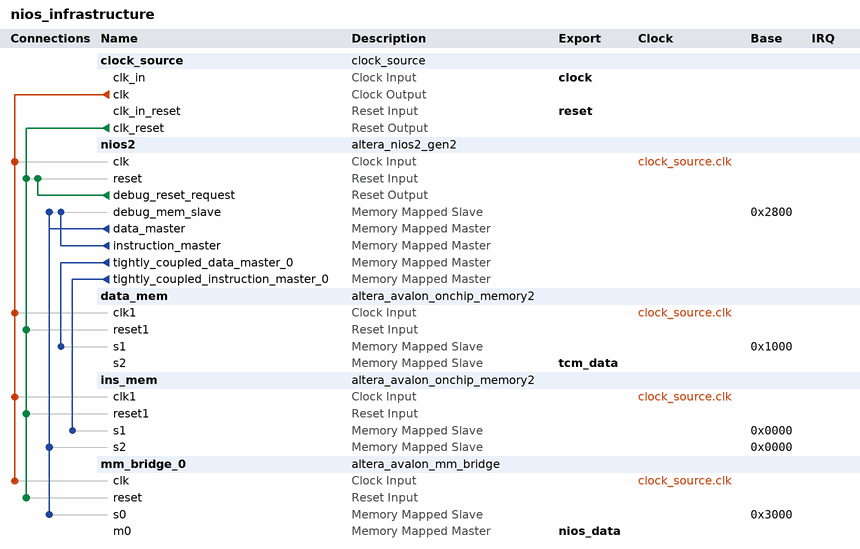
[diagram p0: system contents]
# Platform Designer (Qsys) system nios_infrastructure, Cyclone V 5CSEBA6U23I7
# Parameters at their usual value, and those the tool derives, are not listed.
package require -exact qsys 18.1
create_system nios_infrastructure
set_project_property DEVICE_FAMILY {Cyclone V}
set_project_property DEVICE 5CSEBA6U23I7

add_instance clock_source clock_source 18.1
set_instance_parameter_value clock_source clockFrequency 100000000

add_instance nios2 altera_nios2_gen2 18.1
set_instance_parameter_value nios2 dcache_numTCDM 1
set_instance_parameter_value nios2 dcache_size 0
set_instance_parameter_value nios2 exceptionSlave ins_mem.s1
set_instance_parameter_value nios2 icache_numTCIM 1
set_instance_parameter_value nios2 icache_size 0
set_instance_parameter_value nios2 impl Fast
set_instance_parameter_value nios2 resetSlave ins_mem.s1

add_instance data_mem altera_avalon_onchip_memory2 18.1
set_instance_parameter_value data_mem dataWidth 32
set_instance_parameter_value data_mem dualPort true
set_instance_parameter_value data_mem initMemContent false
set_instance_parameter_value data_mem initializationFileName onchip_mem.hex
set_instance_parameter_value data_mem memorySize 4096
set_instance_parameter_value data_mem singleClockOperation true

add_instance ins_mem altera_avalon_onchip_memory2 18.1
set_instance_parameter_value ins_mem dataWidth 32
set_instance_parameter_value ins_mem dualPort true
set_instance_parameter_value ins_mem initMemContent true
set_instance_parameter_value ins_mem initializationFileName onchip_mem.hex
set_instance_parameter_value ins_mem memorySize 4096
set_instance_parameter_value ins_mem singleClockOperation true

add_instance mm_bridge_0 altera_avalon_mm_bridge 18.1
set_instance_parameter_value mm_bridge_0 ADDRESS_UNITS SYMBOLS
set_instance_parameter_value mm_bridge_0 ADDRESS_WIDTH 10
set_instance_parameter_value mm_bridge_0 DATA_WIDTH 32
set_instance_parameter_value mm_bridge_0 MAX_PENDING_RESPONSES 1
set_instance_parameter_value mm_bridge_0 USE_AUTO_ADDRESS_WIDTH 1

# connections
add_connection clock_source.clk data_mem.clk1 clock
add_connection clock_source.clk ins_mem.clk1 clock
add_connection clock_source.clk mm_bridge_0.clk clock
add_connection clock_source.clk nios2.clk clock
add_connection clock_source.clk_reset data_mem.reset1 reset
add_connection clock_source.clk_reset ins_mem.reset1 reset
add_connection clock_source.clk_reset mm_bridge_0.reset reset
add_connection clock_source.clk_reset nios2.reset reset
add_connection nios2.debug_reset_request nios2.reset reset
add_connection nios2.data_master ins_mem.s2 avalon
set_connection_parameter_value nios2.data_master/ins_mem.s2 baseAddress 0x0000
add_connection nios2.data_master mm_bridge_0.s0 avalon
set_connection_parameter_value nios2.data_master/mm_bridge_0.s0 baseAddress 0x3000
add_connection nios2.data_master nios2.debug_mem_slave avalon
set_connection_parameter_value nios2.data_master/nios2.debug_mem_slave baseAddress 0x2800
add_connection nios2.instruction_master nios2.debug_mem_slave avalon
set_connection_parameter_value nios2.instruction_master/nios2.debug_mem_slave baseAddress 0x2800
add_connection nios2.tightly_coupled_data_master_0 data_mem.s1 avalon
set_connection_parameter_value nios2.tightly_coupled_data_master_0/data_mem.s1 baseAddress 0x1000
add_connection nios2.tightly_coupled_instruction_master_0 ins_mem.s1 avalon
set_connection_parameter_value nios2.tightly_coupled_instruction_master_0/ins_mem.s1 baseAddress 0x0000

# exported interfaces
add_interface clock clock sink
set_interface_property clock EXPORT_OF clock_source.clk_in
add_interface nios_data avalon master
set_interface_property nios_data EXPORT_OF mm_bridge_0.m0
add_interface reset reset sink
set_interface_property reset EXPORT_OF clock_source.clk_in_reset
add_interface tcm_data avalon slave
set_interface_property tcm_data EXPORT_OF data_mem.s2

set_interconnect_requirement {$system} qsys_mm.clockCrossingAdapter HANDSHAKE
set_interconnect_requirement {$system} qsys_mm.enableEccProtection FALSE
set_interconnect_requirement {$system} qsys_mm.insertDefaultSlave FALSE
set_interconnect_requirement {$system} qsys_mm.maxAdditionalLatency 1

save_system nios_infrastructure.qsys
